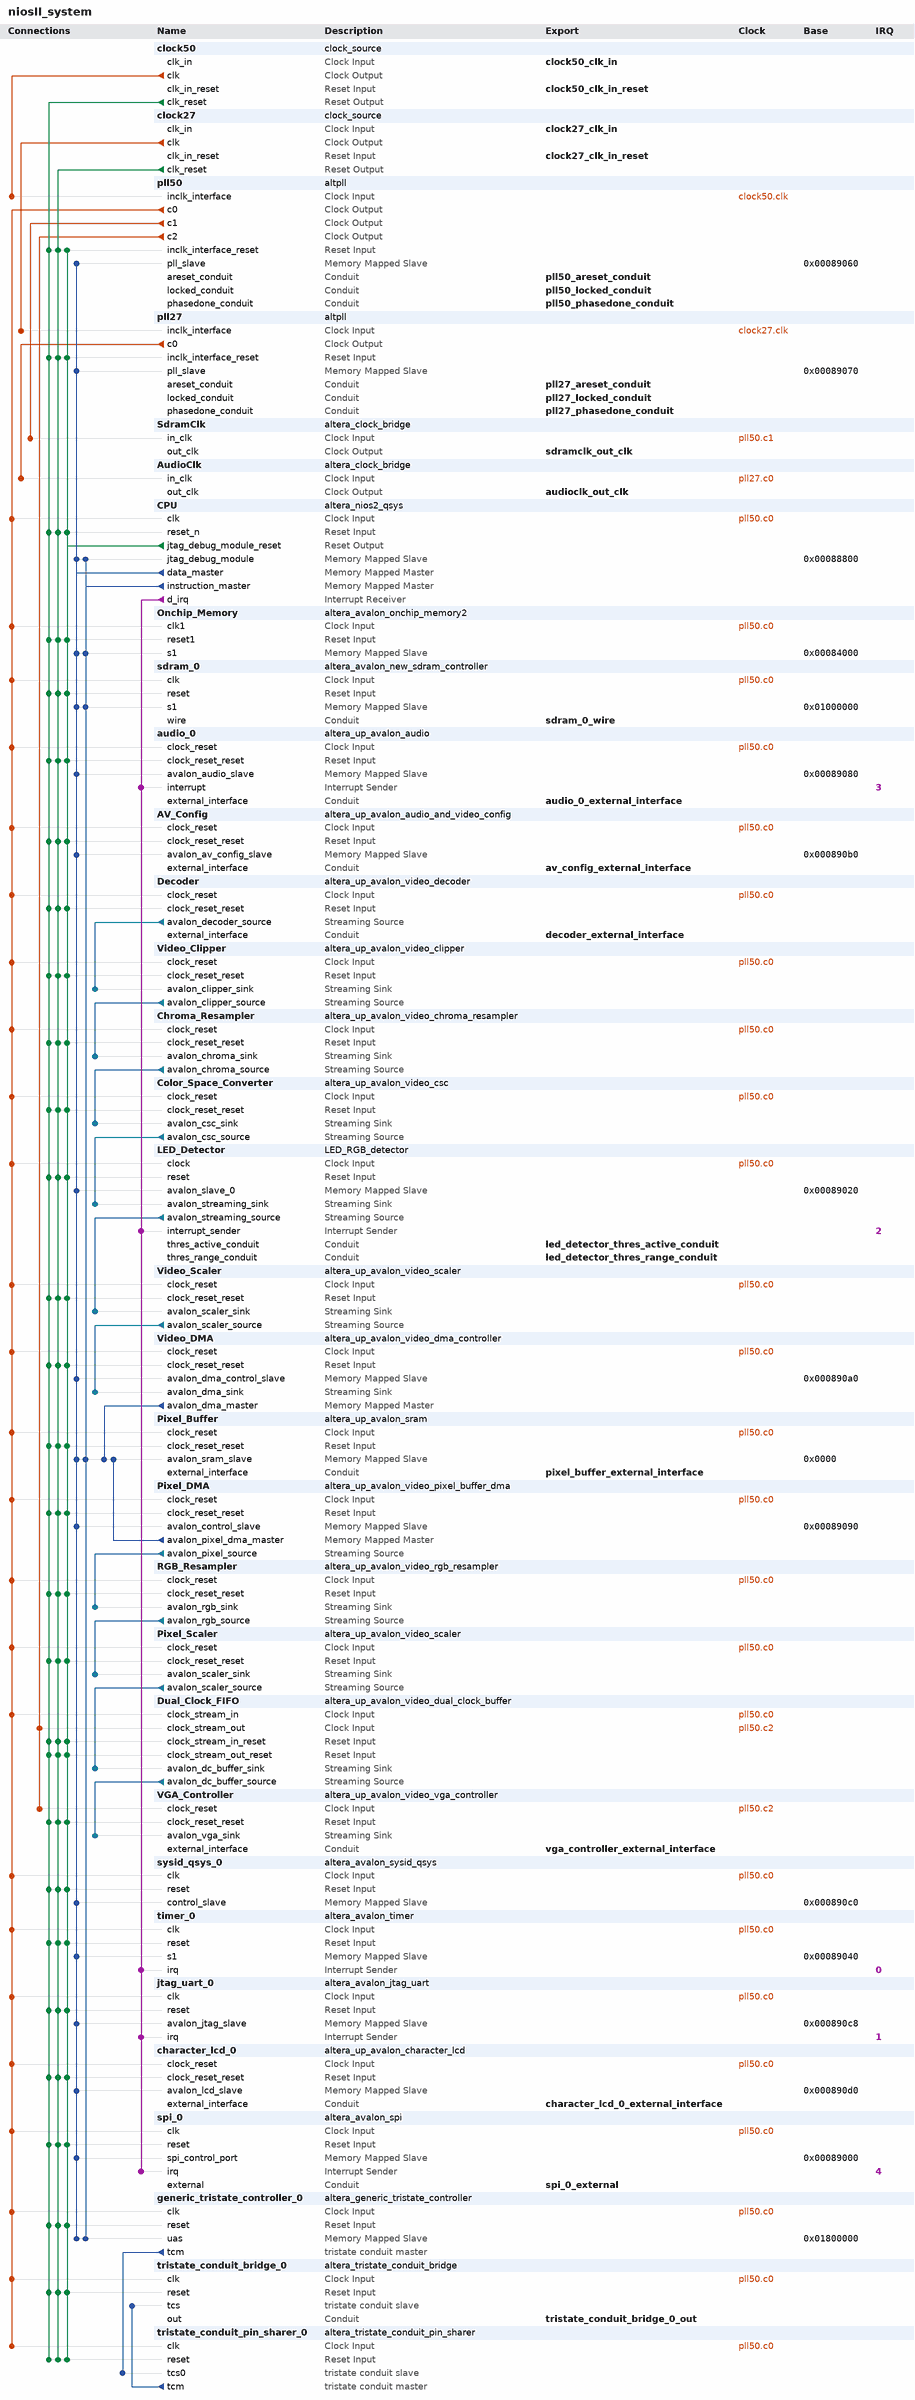
[diagram p0: system contents]
# Platform Designer (Qsys) system niosII_system, Cyclone II EP2C35F672C6
# Parameters at their usual value, and those the tool derives, are not listed.
package require -exact qsys 12.0
create_system niosII_system
set_project_property DEVICE_FAMILY {Cyclone II}
set_project_property DEVICE EP2C35F672C6

add_instance clock50 clock_source 12.1
set_instance_parameter_value clock50 clockFrequency 50000000

add_instance clock27 clock_source 12.1
set_instance_parameter_value clock27 clockFrequency 27000000

add_instance pll50 altpll 12.1
set_instance_parameter_value pll50 INCLK0_INPUT_FREQUENCY 20000
set_instance_parameter_value pll50 GATE_LOCK_SIGNAL NO
set_instance_parameter_value pll50 VALID_LOCK_MULTIPLIER 1
set_instance_parameter_value pll50 INVALID_LOCK_MULTIPLIER 5
set_instance_parameter_value pll50 CLK0_MULTIPLY_BY 3
set_instance_parameter_value pll50 CLK1_MULTIPLY_BY 3
set_instance_parameter_value pll50 CLK2_MULTIPLY_BY 1
set_instance_parameter_value pll50 CLK0_DIVIDE_BY 2
set_instance_parameter_value pll50 CLK1_DIVIDE_BY 2
set_instance_parameter_value pll50 CLK2_DIVIDE_BY 2
set_instance_parameter_value pll50 CLK1_PHASE_SHIFT -3000
set_instance_parameter_value pll50 CLK2_PHASE_SHIFT 0
set_instance_parameter_value pll50 CLK1_DUTY_CYCLE 50
set_instance_parameter_value pll50 CLK2_DUTY_CYCLE 50
set_instance_parameter_value pll50 PORT_clk1 PORT_USED
set_instance_parameter_value pll50 PORT_clk2 PORT_USED
set_instance_parameter_value pll50 PORT_clk3 PORT_UNUSED
set_instance_parameter_value pll50 PORT_ARESET PORT_UNUSED
set_instance_parameter_value pll50 PORT_LOCKED PORT_UNUSED

add_instance pll27 altpll 12.1
set_instance_parameter_value pll27 INCLK0_INPUT_FREQUENCY 37037
set_instance_parameter_value pll27 GATE_LOCK_SIGNAL NO
set_instance_parameter_value pll27 VALID_LOCK_MULTIPLIER 1
set_instance_parameter_value pll27 INVALID_LOCK_MULTIPLIER 5
set_instance_parameter_value pll27 CLK0_MULTIPLY_BY 5
set_instance_parameter_value pll27 CLK0_DIVIDE_BY 8
set_instance_parameter_value pll27 PORT_clk1 PORT_UNUSED
set_instance_parameter_value pll27 PORT_clk2 PORT_UNUSED
set_instance_parameter_value pll27 PORT_clk3 PORT_UNUSED
set_instance_parameter_value pll27 PORT_ARESET PORT_UNUSED
set_instance_parameter_value pll27 PORT_LOCKED PORT_UNUSED

add_instance SdramClk altera_clock_bridge 12.1
set_instance_parameter_value SdramClk DERIVED_CLOCK_RATE 75000000
set_instance_parameter_value SdramClk EXPLICIT_CLOCK_RATE 0

add_instance AudioClk altera_clock_bridge 12.1
set_instance_parameter_value AudioClk DERIVED_CLOCK_RATE 16875000
set_instance_parameter_value AudioClk EXPLICIT_CLOCK_RATE 0

add_instance CPU altera_nios2_qsys 12.1
set_instance_parameter_value CPU manuallyAssignCpuID false
set_instance_parameter_value CPU resetSlave generic_tristate_controller_0.uas
set_instance_parameter_value CPU exceptionSlave Onchip_Memory.s1
set_instance_parameter_value CPU breakSlave CPU.jtag_debug_module
set_instance_parameter_value CPU impl Fast
set_instance_parameter_value CPU icache_size 4096

add_instance Onchip_Memory altera_avalon_onchip_memory2 12.1
set_instance_parameter_value Onchip_Memory dataWidth 32
set_instance_parameter_value Onchip_Memory dualPort false
set_instance_parameter_value Onchip_Memory initMemContent true
set_instance_parameter_value Onchip_Memory initializationFileName Onchip_Memory
set_instance_parameter_value Onchip_Memory memorySize 16384

add_instance sdram_0 altera_avalon_new_sdram_controller 12.1
set_instance_parameter_value sdram_0 TAC 5.5
set_instance_parameter_value sdram_0 TRCD 20.0
set_instance_parameter_value sdram_0 TRP 20.0
set_instance_parameter_value sdram_0 casLatency 3
set_instance_parameter_value sdram_0 columnWidth 8
set_instance_parameter_value sdram_0 dataWidth 16
set_instance_parameter_value sdram_0 generateSimulationModel false
set_instance_parameter_value sdram_0 model custom
set_instance_parameter_value sdram_0 numberOfBanks 4
set_instance_parameter_value sdram_0 numberOfChipSelects 1
set_instance_parameter_value sdram_0 powerUpDelay 100.0
set_instance_parameter_value sdram_0 refreshPeriod 15.625
set_instance_parameter_value sdram_0 rowWidth 12

add_instance audio_0 altera_up_avalon_audio 12.0
set_instance_parameter_value audio_0 avalon_bus_type {Memory Mapped}
set_instance_parameter_value audio_0 audio_in false
set_instance_parameter_value audio_0 dw 16

add_instance AV_Config altera_up_avalon_audio_and_video_config 12.0
set_instance_parameter_value AV_Config board DE2
set_instance_parameter_value AV_Config audio_in {Line In to ADC}
set_instance_parameter_value AV_Config line_in_bypass false
set_instance_parameter_value AV_Config bit_length 16
set_instance_parameter_value AV_Config sampling_rate {48 kHz}

add_instance Decoder altera_up_avalon_video_decoder 12.0

add_instance Video_Clipper altera_up_avalon_video_clipper 12.0
set_instance_parameter_value Video_Clipper drop_left 0
set_instance_parameter_value Video_Clipper drop_right 80
set_instance_parameter_value Video_Clipper color_bits 8
set_instance_parameter_value Video_Clipper color_planes 2

add_instance Chroma_Resampler altera_up_avalon_video_chroma_resampler 12.0

add_instance Color_Space_Converter altera_up_avalon_video_csc 12.0

add_instance LED_Detector LED_RGB_detector 1.0
set_instance_parameter_value LED_Detector IDW 23
set_instance_parameter_value LED_Detector ODW 23

add_instance Video_Scaler altera_up_avalon_video_scaler 12.0
set_instance_parameter_value Video_Scaler width_scaling 0.5
set_instance_parameter_value Video_Scaler height_scaling 1
set_instance_parameter_value Video_Scaler width_in 640
set_instance_parameter_value Video_Scaler color_bits 8
set_instance_parameter_value Video_Scaler color_planes 3

add_instance Video_DMA altera_up_avalon_video_dma_controller 12.0
set_instance_parameter_value Video_DMA mode {From Stream to Memory}
set_instance_parameter_value Video_DMA addr_mode X-Y
set_instance_parameter_value Video_DMA start_address 0
set_instance_parameter_value Video_DMA back_start_address 0
set_instance_parameter_value Video_DMA width 320
set_instance_parameter_value Video_DMA height 240
set_instance_parameter_value Video_DMA color_bits 8
set_instance_parameter_value Video_DMA color_planes 3

add_instance Pixel_Buffer altera_up_avalon_sram 12.0
set_instance_parameter_value Pixel_Buffer board DE2
set_instance_parameter_value Pixel_Buffer pixel_buffer true

add_instance Pixel_DMA altera_up_avalon_video_pixel_buffer_dma 12.0
set_instance_parameter_value Pixel_DMA addr_mode X-Y
set_instance_parameter_value Pixel_DMA start_address 0
set_instance_parameter_value Pixel_DMA back_start_address 0
set_instance_parameter_value Pixel_DMA image_width 320
set_instance_parameter_value Pixel_DMA image_height 240
set_instance_parameter_value Pixel_DMA color_space {24-bit RGB}

add_instance RGB_Resampler altera_up_avalon_video_rgb_resampler 12.0
set_instance_parameter_value RGB_Resampler input_type {24-bit RGB}
set_instance_parameter_value RGB_Resampler output_type {30-bit RGB}
set_instance_parameter_value RGB_Resampler alpha 1023

add_instance Pixel_Scaler altera_up_avalon_video_scaler 12.0
set_instance_parameter_value Pixel_Scaler width_scaling 2
set_instance_parameter_value Pixel_Scaler height_scaling 2
set_instance_parameter_value Pixel_Scaler width_in 320
set_instance_parameter_value Pixel_Scaler color_bits 10
set_instance_parameter_value Pixel_Scaler color_planes 3

add_instance Dual_Clock_FIFO altera_up_avalon_video_dual_clock_buffer 12.0
set_instance_parameter_value Dual_Clock_FIFO color_bits 10

add_instance VGA_Controller altera_up_avalon_video_vga_controller 12.0
set_instance_parameter_value VGA_Controller board DE2

add_instance sysid_qsys_0 altera_avalon_sysid_qsys 12.1
set_instance_parameter_value sysid_qsys_0 id 0

add_instance timer_0 altera_avalon_timer 12.1
set_instance_parameter_value timer_0 period 1
set_instance_parameter_value timer_0 periodUnits MSEC
set_instance_parameter_value timer_0 timerPreset CUSTOM

add_instance jtag_uart_0 altera_avalon_jtag_uart 12.1
set_instance_parameter_value jtag_uart_0 simInteractiveOptions INTERACTIVE_ASCII_OUTPUT

add_instance character_lcd_0 altera_up_avalon_character_lcd 12.0
set_instance_parameter_value character_lcd_0 cursor Normal

add_instance spi_0 altera_avalon_spi 12.1
set_instance_parameter_value spi_0 clockPolarity 0
set_instance_parameter_value spi_0 dataWidth 8
set_instance_parameter_value spi_0 masterSPI true
set_instance_parameter_value spi_0 numberOfSlaves 1
set_instance_parameter_value spi_0 targetClockRate 100000000

add_instance generic_tristate_controller_0 altera_generic_tristate_controller 12.1
set_instance_parameter_value generic_tristate_controller_0 TCM_ADDRESS_W 22
set_instance_parameter_value generic_tristate_controller_0 TCM_DATA_W 8
set_instance_parameter_value generic_tristate_controller_0 TCM_BYTEENABLE_W 1
set_instance_parameter_value generic_tristate_controller_0 TCM_READ_WAIT 160
set_instance_parameter_value generic_tristate_controller_0 TCM_WRITE_WAIT 160
set_instance_parameter_value generic_tristate_controller_0 TCM_SETUP_WAIT 40
set_instance_parameter_value generic_tristate_controller_0 TCM_DATA_HOLD 40
set_instance_parameter_value generic_tristate_controller_0 TCM_MAX_PENDING_READ_TRANSACTIONS 3
set_instance_parameter_value generic_tristate_controller_0 TCM_TURNAROUND_TIME 2
set_instance_parameter_value generic_tristate_controller_0 TCM_TIMING_UNITS 0
set_instance_parameter_value generic_tristate_controller_0 TCM_READLATENCY 2
set_instance_parameter_value generic_tristate_controller_0 TCM_SYMBOLS_PER_WORD 1
set_instance_parameter_value generic_tristate_controller_0 USE_READ 1
set_instance_parameter_value generic_tristate_controller_0 USE_BEGINTRANSFER 0
set_instance_parameter_value generic_tristate_controller_0 USE_BYTEENABLE 0
set_instance_parameter_value generic_tristate_controller_0 USE_OUTPUTENABLE 0
set_instance_parameter_value generic_tristate_controller_0 ACTIVE_LOW_READ 1
set_instance_parameter_value generic_tristate_controller_0 ACTIVE_LOW_BYTEENABLE 0
set_instance_parameter_value generic_tristate_controller_0 ACTIVE_LOW_OUTPUTENABLE 0
set_instance_parameter_value generic_tristate_controller_0 ACTIVE_LOW_BEGINTRANSFER 0
set_instance_parameter_value generic_tristate_controller_0 CHIPSELECT_THROUGH_READLATENCY 0
set_instance_parameter_value generic_tristate_controller_0 MODULE_ASSIGNMENT_KEYS embeddedsw.configuration.isFlash,embeddedsw.configuration.isMemoryDevice,embeddedsw.configuration.isNonVolatileStorage
set_instance_parameter_value generic_tristate_controller_0 MODULE_ASSIGNMENT_VALUES 1,1,1
set_instance_parameter_value generic_tristate_controller_0 INTERFACE_ASSIGNMENT_KEYS embeddedsw.configuration.isFlash,embeddedsw.configuration.isMemoryDevice,embeddedsw.configuration.isNonVolatileStorage
set_instance_parameter_value generic_tristate_controller_0 INTERFACE_ASSIGNMENT_VALUES 1,1,1

add_instance tristate_conduit_bridge_0 altera_tristate_conduit_bridge 12.1

add_instance tristate_conduit_pin_sharer_0 altera_tristate_conduit_pin_sharer 12.1
set_instance_parameter_value tristate_conduit_pin_sharer_0 NUM_INTERFACES 1
set_instance_parameter_value tristate_conduit_pin_sharer_0 MODULE_ORIGIN_LIST generic_tristate_controller_0.tcm,generic_tristate_controller_0.tcm,generic_tristate_controller_0.tcm,generic_tristate_controller_0.tcm,generic_tristate_controller_0.tcm

# connections
add_connection clock27.clk pll27.inclk_interface clock
add_connection clock50.clk pll50.inclk_interface clock
add_connection pll27.c0 AudioClk.in_clk clock
add_connection pll50.c0 audio_0.clock_reset clock
add_connection pll50.c0 AV_Config.clock_reset clock
add_connection pll50.c0 character_lcd_0.clock_reset clock
add_connection pll50.c0 Chroma_Resampler.clock_reset clock
add_connection pll50.c0 Color_Space_Converter.clock_reset clock
add_connection pll50.c0 CPU.clk clock
add_connection pll50.c0 Decoder.clock_reset clock
add_connection pll50.c0 Dual_Clock_FIFO.clock_stream_in clock
add_connection pll50.c0 generic_tristate_controller_0.clk clock
add_connection pll50.c0 jtag_uart_0.clk clock
add_connection pll50.c0 LED_Detector.clock clock
add_connection pll50.c0 Onchip_Memory.clk1 clock
add_connection pll50.c0 Pixel_Buffer.clock_reset clock
add_connection pll50.c0 Pixel_DMA.clock_reset clock
add_connection pll50.c0 Pixel_Scaler.clock_reset clock
add_connection pll50.c0 RGB_Resampler.clock_reset clock
add_connection pll50.c0 sdram_0.clk clock
add_connection pll50.c0 spi_0.clk clock
add_connection pll50.c0 sysid_qsys_0.clk clock
add_connection pll50.c0 timer_0.clk clock
add_connection pll50.c0 tristate_conduit_bridge_0.clk clock
add_connection pll50.c0 tristate_conduit_pin_sharer_0.clk clock
add_connection pll50.c0 Video_Clipper.clock_reset clock
add_connection pll50.c0 Video_DMA.clock_reset clock
add_connection pll50.c0 Video_Scaler.clock_reset clock
add_connection pll50.c1 SdramClk.in_clk clock
add_connection pll50.c2 Dual_Clock_FIFO.clock_stream_out clock
add_connection pll50.c2 VGA_Controller.clock_reset clock
add_connection clock27.clk_reset audio_0.clock_reset_reset reset
add_connection clock27.clk_reset AV_Config.clock_reset_reset reset
add_connection clock27.clk_reset character_lcd_0.clock_reset_reset reset
add_connection clock27.clk_reset Chroma_Resampler.clock_reset_reset reset
add_connection clock27.clk_reset Color_Space_Converter.clock_reset_reset reset
add_connection clock27.clk_reset CPU.reset_n reset
add_connection clock27.clk_reset Decoder.clock_reset_reset reset
add_connection clock27.clk_reset Dual_Clock_FIFO.clock_stream_in_reset reset
add_connection clock27.clk_reset Dual_Clock_FIFO.clock_stream_out_reset reset
add_connection clock27.clk_reset generic_tristate_controller_0.reset reset
add_connection clock27.clk_reset jtag_uart_0.reset reset
add_connection clock27.clk_reset LED_Detector.reset reset
add_connection clock27.clk_reset Onchip_Memory.reset1 reset
add_connection clock27.clk_reset Pixel_Buffer.clock_reset_reset reset
add_connection clock27.clk_reset Pixel_DMA.clock_reset_reset reset
add_connection clock27.clk_reset Pixel_Scaler.clock_reset_reset reset
add_connection clock27.clk_reset pll27.inclk_interface_reset reset
add_connection clock27.clk_reset pll50.inclk_interface_reset reset
add_connection clock27.clk_reset RGB_Resampler.clock_reset_reset reset
add_connection clock27.clk_reset sdram_0.reset reset
add_connection clock27.clk_reset spi_0.reset reset
add_connection clock27.clk_reset sysid_qsys_0.reset reset
add_connection clock27.clk_reset timer_0.reset reset
add_connection clock27.clk_reset tristate_conduit_bridge_0.reset reset
add_connection clock27.clk_reset tristate_conduit_pin_sharer_0.reset reset
add_connection clock27.clk_reset VGA_Controller.clock_reset_reset reset
add_connection clock27.clk_reset Video_Clipper.clock_reset_reset reset
add_connection clock27.clk_reset Video_DMA.clock_reset_reset reset
add_connection clock27.clk_reset Video_Scaler.clock_reset_reset reset
add_connection clock50.clk_reset audio_0.clock_reset_reset reset
add_connection clock50.clk_reset AV_Config.clock_reset_reset reset
add_connection clock50.clk_reset character_lcd_0.clock_reset_reset reset
add_connection clock50.clk_reset Chroma_Resampler.clock_reset_reset reset
add_connection clock50.clk_reset Color_Space_Converter.clock_reset_reset reset
add_connection clock50.clk_reset CPU.reset_n reset
add_connection clock50.clk_reset Decoder.clock_reset_reset reset
add_connection clock50.clk_reset Dual_Clock_FIFO.clock_stream_in_reset reset
add_connection clock50.clk_reset Dual_Clock_FIFO.clock_stream_out_reset reset
add_connection clock50.clk_reset generic_tristate_controller_0.reset reset
add_connection clock50.clk_reset jtag_uart_0.reset reset
add_connection clock50.clk_reset LED_Detector.reset reset
add_connection clock50.clk_reset Onchip_Memory.reset1 reset
add_connection clock50.clk_reset Pixel_Buffer.clock_reset_reset reset
add_connection clock50.clk_reset Pixel_DMA.clock_reset_reset reset
add_connection clock50.clk_reset Pixel_Scaler.clock_reset_reset reset
add_connection clock50.clk_reset pll27.inclk_interface_reset reset
add_connection clock50.clk_reset pll50.inclk_interface_reset reset
add_connection clock50.clk_reset RGB_Resampler.clock_reset_reset reset
add_connection clock50.clk_reset sdram_0.reset reset
add_connection clock50.clk_reset spi_0.reset reset
add_connection clock50.clk_reset sysid_qsys_0.reset reset
add_connection clock50.clk_reset timer_0.reset reset
add_connection clock50.clk_reset tristate_conduit_bridge_0.reset reset
add_connection clock50.clk_reset tristate_conduit_pin_sharer_0.reset reset
add_connection clock50.clk_reset VGA_Controller.clock_reset_reset reset
add_connection clock50.clk_reset Video_Clipper.clock_reset_reset reset
add_connection clock50.clk_reset Video_DMA.clock_reset_reset reset
add_connection clock50.clk_reset Video_Scaler.clock_reset_reset reset
add_connection CPU.jtag_debug_module_reset audio_0.clock_reset_reset reset
add_connection CPU.jtag_debug_module_reset AV_Config.clock_reset_reset reset
add_connection CPU.jtag_debug_module_reset character_lcd_0.clock_reset_reset reset
add_connection CPU.jtag_debug_module_reset Chroma_Resampler.clock_reset_reset reset
add_connection CPU.jtag_debug_module_reset Color_Space_Converter.clock_reset_reset reset
add_connection CPU.jtag_debug_module_reset CPU.reset_n reset
add_connection CPU.jtag_debug_module_reset Decoder.clock_reset_reset reset
add_connection CPU.jtag_debug_module_reset Dual_Clock_FIFO.clock_stream_in_reset reset
add_connection CPU.jtag_debug_module_reset Dual_Clock_FIFO.clock_stream_out_reset reset
add_connection CPU.jtag_debug_module_reset generic_tristate_controller_0.reset reset
add_connection CPU.jtag_debug_module_reset jtag_uart_0.reset reset
add_connection CPU.jtag_debug_module_reset LED_Detector.reset reset
add_connection CPU.jtag_debug_module_reset Onchip_Memory.reset1 reset
add_connection CPU.jtag_debug_module_reset Pixel_Buffer.clock_reset_reset reset
add_connection CPU.jtag_debug_module_reset Pixel_DMA.clock_reset_reset reset
add_connection CPU.jtag_debug_module_reset Pixel_Scaler.clock_reset_reset reset
add_connection CPU.jtag_debug_module_reset pll27.inclk_interface_reset reset
add_connection CPU.jtag_debug_module_reset pll50.inclk_interface_reset reset
add_connection CPU.jtag_debug_module_reset RGB_Resampler.clock_reset_reset reset
add_connection CPU.jtag_debug_module_reset sdram_0.reset reset
add_connection CPU.jtag_debug_module_reset spi_0.reset reset
add_connection CPU.jtag_debug_module_reset sysid_qsys_0.reset reset
add_connection CPU.jtag_debug_module_reset timer_0.reset reset
add_connection CPU.jtag_debug_module_reset tristate_conduit_bridge_0.reset reset
add_connection CPU.jtag_debug_module_reset tristate_conduit_pin_sharer_0.reset reset
add_connection CPU.jtag_debug_module_reset VGA_Controller.clock_reset_reset reset
add_connection CPU.jtag_debug_module_reset Video_Clipper.clock_reset_reset reset
add_connection CPU.jtag_debug_module_reset Video_DMA.clock_reset_reset reset
add_connection CPU.jtag_debug_module_reset Video_Scaler.clock_reset_reset reset
add_connection CPU.data_master audio_0.avalon_audio_slave avalon
set_connection_parameter_value CPU.data_master/audio_0.avalon_audio_slave baseAddress 0x00089080
add_connection CPU.data_master AV_Config.avalon_av_config_slave avalon
set_connection_parameter_value CPU.data_master/AV_Config.avalon_av_config_slave baseAddress 0x000890b0
add_connection CPU.data_master character_lcd_0.avalon_lcd_slave avalon
set_connection_parameter_value CPU.data_master/character_lcd_0.avalon_lcd_slave baseAddress 0x000890d0
add_connection CPU.data_master CPU.jtag_debug_module avalon
set_connection_parameter_value CPU.data_master/CPU.jtag_debug_module baseAddress 0x00088800
add_connection CPU.data_master generic_tristate_controller_0.uas avalon
set_connection_parameter_value CPU.data_master/generic_tristate_controller_0.uas baseAddress 0x01800000
add_connection CPU.data_master jtag_uart_0.avalon_jtag_slave avalon
set_connection_parameter_value CPU.data_master/jtag_uart_0.avalon_jtag_slave baseAddress 0x000890c8
add_connection CPU.data_master LED_Detector.avalon_slave_0 avalon
set_connection_parameter_value CPU.data_master/LED_Detector.avalon_slave_0 baseAddress 0x00089020
add_connection CPU.data_master Onchip_Memory.s1 avalon
set_connection_parameter_value CPU.data_master/Onchip_Memory.s1 baseAddress 0x00084000
add_connection CPU.data_master Pixel_Buffer.avalon_sram_slave avalon
set_connection_parameter_value CPU.data_master/Pixel_Buffer.avalon_sram_slave baseAddress 0x0000
add_connection CPU.data_master Pixel_DMA.avalon_control_slave avalon
set_connection_parameter_value CPU.data_master/Pixel_DMA.avalon_control_slave baseAddress 0x00089090
add_connection CPU.data_master pll27.pll_slave avalon
set_connection_parameter_value CPU.data_master/pll27.pll_slave baseAddress 0x00089070
add_connection CPU.data_master pll50.pll_slave avalon
set_connection_parameter_value CPU.data_master/pll50.pll_slave baseAddress 0x00089060
add_connection CPU.data_master sdram_0.s1 avalon
set_connection_parameter_value CPU.data_master/sdram_0.s1 baseAddress 0x01000000
add_connection CPU.data_master spi_0.spi_control_port avalon
set_connection_parameter_value CPU.data_master/spi_0.spi_control_port baseAddress 0x00089000
add_connection CPU.data_master sysid_qsys_0.control_slave avalon
set_connection_parameter_value CPU.data_master/sysid_qsys_0.control_slave baseAddress 0x000890c0
add_connection CPU.data_master timer_0.s1 avalon
set_connection_parameter_value CPU.data_master/timer_0.s1 baseAddress 0x00089040
add_connection CPU.data_master Video_DMA.avalon_dma_control_slave avalon
set_connection_parameter_value CPU.data_master/Video_DMA.avalon_dma_control_slave baseAddress 0x000890a0
add_connection CPU.instruction_master CPU.jtag_debug_module avalon
set_connection_parameter_value CPU.instruction_master/CPU.jtag_debug_module baseAddress 0x00088800
add_connection CPU.instruction_master generic_tristate_controller_0.uas avalon
set_connection_parameter_value CPU.instruction_master/generic_tristate_controller_0.uas baseAddress 0x01800000
add_connection CPU.instruction_master Onchip_Memory.s1 avalon
set_connection_parameter_value CPU.instruction_master/Onchip_Memory.s1 baseAddress 0x00084000
add_connection CPU.instruction_master Pixel_Buffer.avalon_sram_slave avalon
set_connection_parameter_value CPU.instruction_master/Pixel_Buffer.avalon_sram_slave baseAddress 0x0000
add_connection CPU.instruction_master sdram_0.s1 avalon
set_connection_parameter_value CPU.instruction_master/sdram_0.s1 baseAddress 0x01000000
add_connection Pixel_DMA.avalon_pixel_dma_master Pixel_Buffer.avalon_sram_slave avalon
set_connection_parameter_value Pixel_DMA.avalon_pixel_dma_master/Pixel_Buffer.avalon_sram_slave baseAddress 0x0000
add_connection Video_DMA.avalon_dma_master Pixel_Buffer.avalon_sram_slave avalon
set_connection_parameter_value Video_DMA.avalon_dma_master/Pixel_Buffer.avalon_sram_slave baseAddress 0x0000
add_connection Chroma_Resampler.avalon_chroma_source Color_Space_Converter.avalon_csc_sink avalon_streaming
add_connection Color_Space_Converter.avalon_csc_source LED_Detector.avalon_streaming_sink avalon_streaming
add_connection Decoder.avalon_decoder_source Video_Clipper.avalon_clipper_sink avalon_streaming
add_connection Dual_Clock_FIFO.avalon_dc_buffer_source VGA_Controller.avalon_vga_sink avalon_streaming
add_connection LED_Detector.avalon_streaming_source Video_Scaler.avalon_scaler_sink avalon_streaming
add_connection Pixel_DMA.avalon_pixel_source RGB_Resampler.avalon_rgb_sink avalon_streaming
add_connection Pixel_Scaler.avalon_scaler_source Dual_Clock_FIFO.avalon_dc_buffer_sink avalon_streaming
add_connection RGB_Resampler.avalon_rgb_source Pixel_Scaler.avalon_scaler_sink avalon_streaming
add_connection Video_Clipper.avalon_clipper_source Chroma_Resampler.avalon_chroma_sink avalon_streaming
add_connection Video_Scaler.avalon_scaler_source Video_DMA.avalon_dma_sink avalon_streaming
add_connection CPU.d_irq audio_0.interrupt interrupt
set_connection_parameter_value CPU.d_irq/audio_0.interrupt irqNumber 3
add_connection CPU.d_irq jtag_uart_0.irq interrupt
set_connection_parameter_value CPU.d_irq/jtag_uart_0.irq irqNumber 1
add_connection CPU.d_irq LED_Detector.interrupt_sender interrupt
set_connection_parameter_value CPU.d_irq/LED_Detector.interrupt_sender irqNumber 2
add_connection CPU.d_irq spi_0.irq interrupt
set_connection_parameter_value CPU.d_irq/spi_0.irq irqNumber 4
add_connection CPU.d_irq timer_0.irq interrupt
set_connection_parameter_value CPU.d_irq/timer_0.irq irqNumber 0
add_connection generic_tristate_controller_0.tcm tristate_conduit_pin_sharer_0.tcs0 tristate_conduit
add_connection tristate_conduit_pin_sharer_0.tcm tristate_conduit_bridge_0.tcs tristate_conduit

# exported interfaces
add_interface pixel_buffer_external_interface conduit end
set_interface_property pixel_buffer_external_interface EXPORT_OF Pixel_Buffer.external_interface
add_interface av_config_external_interface conduit end
set_interface_property av_config_external_interface EXPORT_OF AV_Config.external_interface
add_interface decoder_external_interface conduit end
set_interface_property decoder_external_interface EXPORT_OF Decoder.external_interface
add_interface vga_controller_external_interface conduit end
set_interface_property vga_controller_external_interface EXPORT_OF VGA_Controller.external_interface
add_interface sdram_0_wire conduit end
set_interface_property sdram_0_wire EXPORT_OF sdram_0.wire
add_interface character_lcd_0_external_interface conduit end
set_interface_property character_lcd_0_external_interface EXPORT_OF character_lcd_0.external_interface
add_interface led_detector_thres_active_conduit conduit end
set_interface_property led_detector_thres_active_conduit EXPORT_OF LED_Detector.thres_active_conduit
add_interface led_detector_thres_range_conduit conduit end
set_interface_property led_detector_thres_range_conduit EXPORT_OF LED_Detector.thres_range_conduit
add_interface audio_0_external_interface conduit end
set_interface_property audio_0_external_interface EXPORT_OF audio_0.external_interface
add_interface spi_0_external conduit end
set_interface_property spi_0_external EXPORT_OF spi_0.external
add_interface clock50_clk_in clock sink
set_interface_property clock50_clk_in EXPORT_OF clock50.clk_in
add_interface clock50_clk_in_reset reset sink
set_interface_property clock50_clk_in_reset EXPORT_OF clock50.clk_in_reset
add_interface clock27_clk_in clock sink
set_interface_property clock27_clk_in EXPORT_OF clock27.clk_in
add_interface clock27_clk_in_reset reset sink
set_interface_property clock27_clk_in_reset EXPORT_OF clock27.clk_in_reset
add_interface audioclk_out_clk clock source
set_interface_property audioclk_out_clk EXPORT_OF AudioClk.out_clk
add_interface sdramclk_out_clk clock source
set_interface_property sdramclk_out_clk EXPORT_OF SdramClk.out_clk
add_interface pll50_areset_conduit conduit end
set_interface_property pll50_areset_conduit EXPORT_OF pll50.areset_conduit
add_interface pll50_locked_conduit conduit end
set_interface_property pll50_locked_conduit EXPORT_OF pll50.locked_conduit
add_interface pll50_phasedone_conduit conduit end
set_interface_property pll50_phasedone_conduit EXPORT_OF pll50.phasedone_conduit
add_interface pll27_areset_conduit conduit end
set_interface_property pll27_areset_conduit EXPORT_OF pll27.areset_conduit
add_interface pll27_locked_conduit conduit end
set_interface_property pll27_locked_conduit EXPORT_OF pll27.locked_conduit
add_interface pll27_phasedone_conduit conduit end
set_interface_property pll27_phasedone_conduit EXPORT_OF pll27.phasedone_conduit
add_interface tristate_conduit_bridge_0_out conduit end
set_interface_property tristate_conduit_bridge_0_out EXPORT_OF tristate_conduit_bridge_0.out

save_system niosII_system.qsys
